# Altium schematic sheet Main.SchDoc
size A
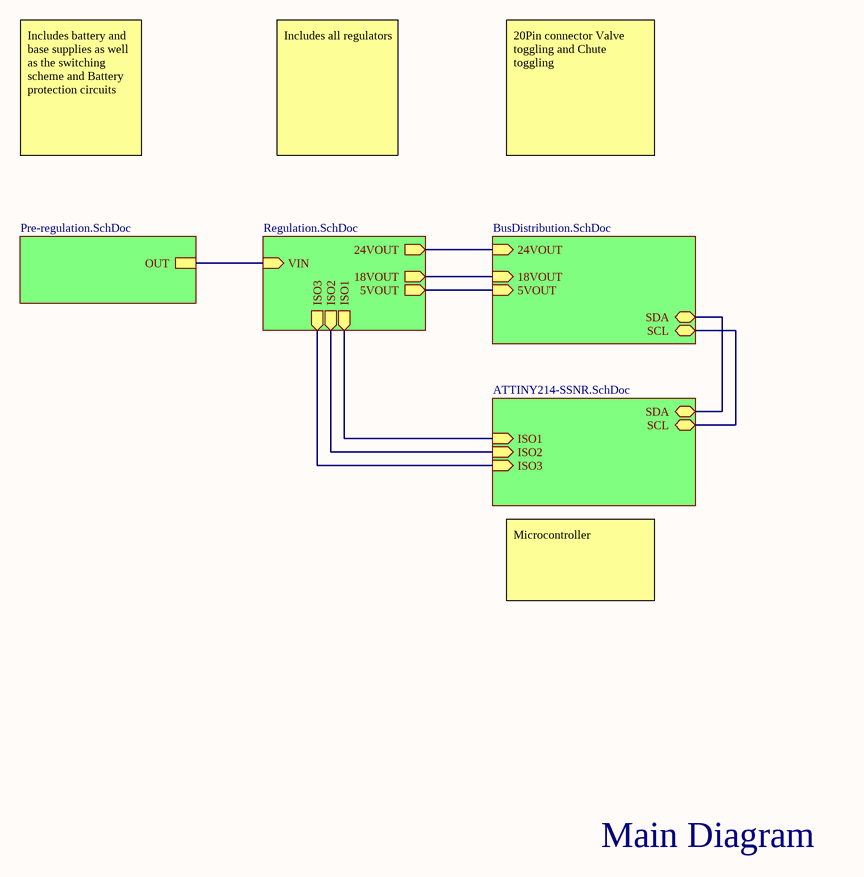
[diagram p0: Main.SchDoc]

## Sub-sheets
U_BusDistribution = BusDistribution.SchDoc: 24VOUT (in), 5VOUT (in), 18VOUT (in), SDA (bidir), SCL (bidir)
U_Intrumentation = ATTINY214-SSNR.SchDoc: SDA (bidir), SCL (bidir), ISO1 (in), ISO2 (in), ISO3 (in)
U_Regulation = Regulation.SchDoc: ISO1 (out), ISO2 (out), ISO3 (out), 24VOUT (out), VIN (in), 18VOUT (out), 5VOUT (out)
U_Supply&Switching = Pre-regulation.SchDoc: OUT

## Nets
(unnamed): sheet U_Intrumentation/SDA, sheet U_BusDistribution/SDA
(unnamed): sheet U_Intrumentation/SCL, sheet U_BusDistribution/SCL
(unnamed): sheet U_Intrumentation/ISO1, sheet U_Regulation/ISO1
(unnamed): sheet U_Intrumentation/ISO2, sheet U_Regulation/ISO2
(unnamed): sheet U_Intrumentation/ISO3, sheet U_Regulation/ISO3
(unnamed): sheet U_Supply&Switching/OUT, sheet U_Regulation/VIN
(unnamed): sheet U_Regulation/24VOUT, sheet U_BusDistribution/24VOUT
(unnamed): sheet U_Regulation/18VOUT, sheet U_BusDistribution/18VOUT
(unnamed): sheet U_Regulation/5VOUT, sheet U_BusDistribution/5VOUT

## Notes on the sheet
- Includes battery and base supplies as well as the switching scheme and Battery protection circuits
- Includes all regulators
- 20Pin connector Valve toggling and Chute toggling
- Microcontroller
- Main Diagram